# Altium schematic sheet relays1.SchDoc
size A4
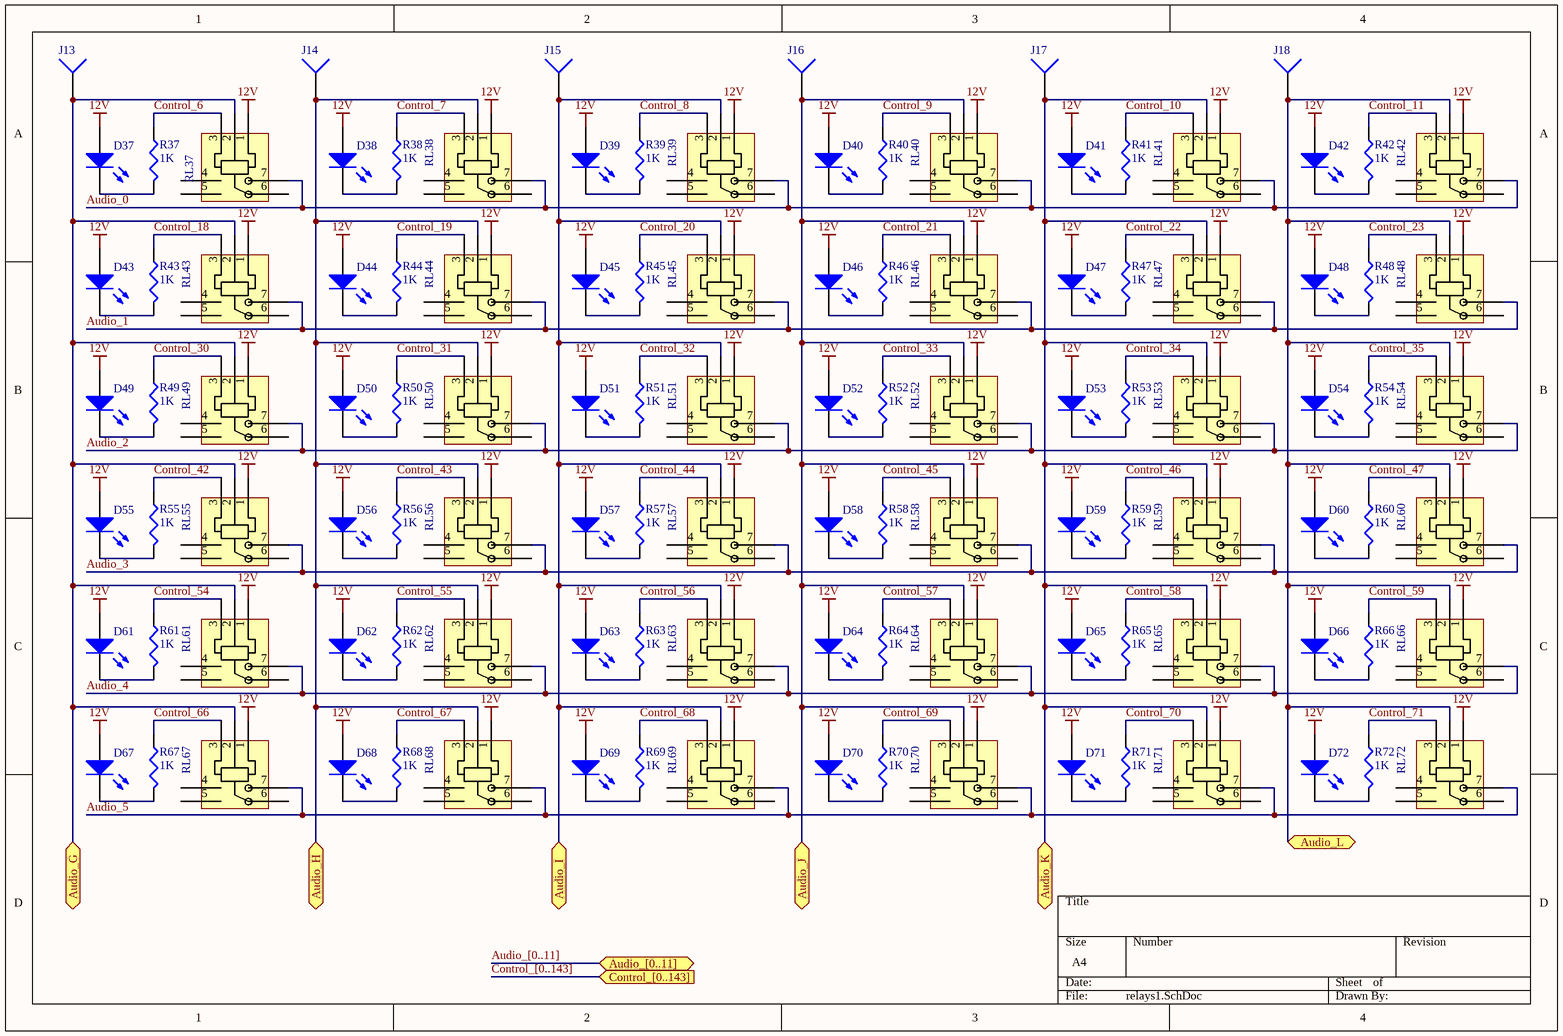
[diagram p0: relays1.SchDoc]

## Parts
D37  LED0  [LED_round_5mm]  (value not drawn)
D38  LED0  [LED_round_5mm]  (value not drawn)
D39  LED0  [LED_round_5mm]  (value not drawn)
D40  LED0  [LED_round_5mm]  (value not drawn)
D41  LED0  [LED_round_5mm]  (value not drawn)
D42  LED0  [LED_round_5mm]  (value not drawn)
D43  LED0  [LED_round_5mm]  (value not drawn)
D44  LED0  [LED_round_5mm]  (value not drawn)
D45  LED0  [LED_round_5mm]  (value not drawn)
D46  LED0  [LED_round_5mm]  (value not drawn)
D47  LED0  [LED_round_5mm]  (value not drawn)
D48  LED0  [LED_round_5mm]  (value not drawn)
D49  LED0  [LED_round_5mm]  (value not drawn)
D50  LED0  [LED_round_5mm]  (value not drawn)
D51  LED0  [LED_round_5mm]  (value not drawn)
D52  LED0  [LED_round_5mm]  (value not drawn)
D53  LED0  [LED_round_5mm]  (value not drawn)
D54  LED0  [LED_round_5mm]  (value not drawn)
D55  LED0  [LED_round_5mm]  (value not drawn)
D56  LED0  [LED_round_5mm]  (value not drawn)
D57  LED0  [LED_round_5mm]  (value not drawn)
D58  LED0  [LED_round_5mm]  (value not drawn)
D59  LED0  [LED_round_5mm]  (value not drawn)
D60  LED0  [LED_round_5mm]  (value not drawn)
D61  LED0  [LED_round_5mm]  (value not drawn)
D62  LED0  [LED_round_5mm]  (value not drawn)
D63  LED0  [LED_round_5mm]  (value not drawn)
D64  LED0  [LED_round_5mm]  (value not drawn)
D65  LED0  [LED_round_5mm]  (value not drawn)
D66  LED0  [LED_round_5mm]  (value not drawn)
D67  LED0  [LED_round_5mm]  (value not drawn)
D68  LED0  [LED_round_5mm]  (value not drawn)
D69  LED0  [LED_round_5mm]  (value not drawn)
D70  LED0  [LED_round_5mm]  (value not drawn)
D71  LED0  [LED_round_5mm]  (value not drawn)
D72  LED0  [LED_round_5mm]  (value not drawn)
J13  Audio  [Conn_1_2x4]  (value not drawn)
J14  Audio  [Conn_1_2x4]  (value not drawn)
J15  Audio  [Conn_1_2x4]  (value not drawn)
J16  Audio  [Conn_1_2x4]  (value not drawn)
J17  Audio  [Conn_1_2x4]  (value not drawn)
J18  Audio  [Conn_1_2x4]  (value not drawn)
R37  value 1K  [J1-0603]  (hidden comment: Res3)
R38  value 1K  [J1-0603]  (hidden comment: Res3)
R39  value 1K  [J1-0603]  (hidden comment: Res3)
R40  value 1K  [J1-0603]  (hidden comment: Res3)
R41  value 1K  [J1-0603]  (hidden comment: Res3)
R42  value 1K  [J1-0603]  (hidden comment: Res3)
R43  value 1K  [J1-0603]  (hidden comment: Res3)
R44  value 1K  [J1-0603]  (hidden comment: Res3)
R45  value 1K  [J1-0603]  (hidden comment: Res3)
R46  value 1K  [J1-0603]  (hidden comment: Res3)
R47  value 1K  [J1-0603]  (hidden comment: Res3)
R48  value 1K  [J1-0603]  (hidden comment: Res3)
R49  value 1K  [J1-0603]  (hidden comment: Res3)
R50  value 1K  [J1-0603]  (hidden comment: Res3)
R51  value 1K  [J1-0603]  (hidden comment: Res3)
R52  value 1K  [J1-0603]  (hidden comment: Res3)
R53  value 1K  [J1-0603]  (hidden comment: Res3)
R54  value 1K  [J1-0603]  (hidden comment: Res3)
R55  value 1K  [J1-0603]  (hidden comment: Res3)
R56  value 1K  [J1-0603]  (hidden comment: Res3)
R57  value 1K  [J1-0603]  (hidden comment: Res3)
R58  value 1K  [J1-0603]  (hidden comment: Res3)
R59  value 1K  [J1-0603]  (hidden comment: Res3)
R60  value 1K  [J1-0603]  (hidden comment: Res3)
R61  value 1K  [J1-0603]  (hidden comment: Res3)
R62  value 1K  [J1-0603]  (hidden comment: Res3)
R63  value 1K  [J1-0603]  (hidden comment: Res3)
R64  value 1K  [J1-0603]  (hidden comment: Res3)
R65  value 1K  [J1-0603]  (hidden comment: Res3)
R66  value 1K  [J1-0603]  (hidden comment: Res3)
R67  value 1K  [J1-0603]  (hidden comment: Res3)
R68  value 1K  [J1-0603]  (hidden comment: Res3)
R69  value 1K  [J1-0603]  (hidden comment: Res3)
R70  value 1K  [J1-0603]  (hidden comment: Res3)
R71  value 1K  [J1-0603]  (hidden comment: Res3)
R72  value 1K  [J1-0603]  (hidden comment: Res3)
RL37  Relay  [Relay_FRA3]  (value not drawn)
RL38  Relay  [Relay_FRA3]  (value not drawn)
RL39  Relay  [Relay_FRA3]  (value not drawn)
RL40  Relay  [Relay_FRA3]  (value not drawn)
RL41  Relay  [Relay_FRA3]  (value not drawn)
RL42  Relay  [Relay_FRA3]  (value not drawn)
RL43  Relay  [Relay_FRA3]  (value not drawn)
RL44  Relay  [Relay_FRA3]  (value not drawn)
RL45  Relay  [Relay_FRA3]  (value not drawn)
RL46  Relay  [Relay_FRA3]  (value not drawn)
RL47  Relay  [Relay_FRA3]  (value not drawn)
RL48  Relay  [Relay_FRA3]  (value not drawn)
RL49  Relay  [Relay_FRA3]  (value not drawn)
RL50  Relay  [Relay_FRA3]  (value not drawn)
RL51  Relay  [Relay_FRA3]  (value not drawn)
RL52  Relay  [Relay_FRA3]  (value not drawn)
RL53  Relay  [Relay_FRA3]  (value not drawn)
RL54  Relay  [Relay_FRA3]  (value not drawn)
RL55  Relay  [Relay_FRA3]  (value not drawn)
RL56  Relay  [Relay_FRA3]  (value not drawn)
RL57  Relay  [Relay_FRA3]  (value not drawn)
RL58  Relay  [Relay_FRA3]  (value not drawn)
RL59  Relay  [Relay_FRA3]  (value not drawn)
RL60  Relay  [Relay_FRA3]  (value not drawn)
RL61  Relay  [Relay_FRA3]  (value not drawn)
RL62  Relay  [Relay_FRA3]  (value not drawn)
RL63  Relay  [Relay_FRA3]  (value not drawn)
RL64  Relay  [Relay_FRA3]  (value not drawn)
RL65  Relay  [Relay_FRA3]  (value not drawn)
RL66  Relay  [Relay_FRA3]  (value not drawn)
RL67  Relay  [Relay_FRA3]  (value not drawn)
RL68  Relay  [Relay_FRA3]  (value not drawn)
RL69  Relay  [Relay_FRA3]  (value not drawn)
RL70  Relay  [Relay_FRA3]  (value not drawn)
RL71  Relay  [Relay_FRA3]  (value not drawn)
RL72  Relay  [Relay_FRA3]  (value not drawn)

## Ports
Audio_[0..11] (bidir), Audio_G (bidir), Audio_H (bidir), Audio_I (bidir), Audio_J (bidir), Audio_K (bidir), Audio_L (bidir), Control_[0..143] (in)

## Nets
12V: D37.1(A) D38.1(A) D39.1(A) D40.1(A) D41.1(A) D42.1(A) D43.1(A) D44.1(A) D45.1(A) D46.1(A) D47.1(A) D48.1(A) D49.1(A) D50.1(A) D51.1(A) D52.1(A) D53.1(A) D54.1(A) D55.1(A) D56.1(A) D57.1(A) D58.1(A) D59.1(A) D60.1(A) D61.1(A) D62.1(A) D63.1(A) D64.1(A) D65.1(A) D66.1(A) D67.1(A) D68.1(A) D69.1(A) D70.1(A) D71.1(A) D72.1(A) RL37.1 RL38.1 RL39.1 RL40.1 RL41.1 RL42.1 RL43.1 RL44.1 RL45.1 RL46.1 RL47.1 RL48.1 RL49.1 RL50.1 RL51.1 RL52.1 RL53.1 RL54.1 RL55.1 RL56.1 RL57.1 RL58.1 RL59.1 RL60.1 RL61.1 RL62.1 RL63.1 RL64.1 RL65.1 RL66.1 RL67.1 RL68.1 RL69.1 RL70.1 RL71.1 RL72.1
Audio_0: RL37.7 RL38.7 RL39.7 RL40.7 RL41.7 RL42.7
Audio_1: RL43.7 RL44.7 RL45.7 RL46.7 RL47.7 RL48.7
Audio_2: RL49.7 RL50.7 RL51.7 RL52.7 RL53.7 RL54.7
Audio_3: RL55.7 RL56.7 RL57.7 RL58.7 RL59.7 RL60.7
Audio_4: RL61.7 RL62.7 RL63.7 RL64.7 RL65.7 RL66.7
Audio_5: RL67.7 RL68.7 RL69.7 RL70.7 RL71.7 RL72.7
Audio_G: J13.1 RL37.2 RL43.2 RL49.2 RL55.2 RL61.2 RL67.2 ; port Audio_G
Audio_H: J14.1 RL38.2 RL44.2 RL50.2 RL56.2 RL62.2 RL68.2 ; port Audio_H
Audio_I: J15.1 RL39.2 RL45.2 RL51.2 RL57.2 RL63.2 RL69.2 ; port Audio_I
Audio_J: J16.1 RL40.2 RL46.2 RL52.2 RL58.2 RL64.2 RL70.2 ; port Audio_J
Audio_K: J17.1 RL41.2 RL47.2 RL53.2 RL59.2 RL65.2 RL71.2 ; port Audio_K
Audio_L: J18.1 RL42.2 RL48.2 RL54.2 RL60.2 RL66.2 RL72.2 ; port Audio_L
Control_6: R37.1 RL37.3
Control_7: R38.1 RL38.3
Control_8: R39.1 RL39.3
Control_9: R40.1 RL40.3
Control_10: R41.1 RL41.3
Control_11: R42.1 RL42.3
Control_18: R43.1 RL43.3
Control_19: R44.1 RL44.3
Control_20: R45.1 RL45.3
Control_21: R46.1 RL46.3
Control_22: R47.1 RL47.3
Control_23: R48.1 RL48.3
Control_30: R49.1 RL49.3
Control_31: R50.1 RL50.3
Control_32: R51.1 RL51.3
Control_33: R52.1 RL52.3
Control_34: R53.1 RL53.3
Control_35: R54.1 RL54.3
Control_42: R55.1 RL55.3
Control_43: R56.1 RL56.3
Control_44: R57.1 RL57.3
Control_45: R58.1 RL58.3
Control_46: R59.1 RL59.3
Control_47: R60.1 RL60.3
Control_54: R61.1 RL61.3
Control_55: R62.1 RL62.3
Control_56: R63.1 RL63.3
Control_57: R64.1 RL64.3
Control_58: R65.1 RL65.3
Control_59: R66.1 RL66.3
Control_66: R67.1 RL67.3
Control_67: R68.1 RL68.3
Control_68: R69.1 RL69.3
Control_69: R70.1 RL70.3
Control_70: R71.1 RL71.3
Control_71: R72.1 RL72.3
NetD37_2: D37.2(K) R37.2
NetD38_2: D38.2(K) R38.2
NetD39_2: D39.2(K) R39.2
NetD40_2: D40.2(K) R40.2
NetD41_2: D41.2(K) R41.2
NetD42_2: D42.2(K) R42.2
NetD43_2: D43.2(K) R43.2
NetD44_2: D44.2(K) R44.2
NetD45_2: D45.2(K) R45.2
NetD46_2: D46.2(K) R46.2
NetD47_2: D47.2(K) R47.2
NetD48_2: D48.2(K) R48.2
NetD49_2: D49.2(K) R49.2
NetD50_2: D50.2(K) R50.2
NetD51_2: D51.2(K) R51.2
NetD52_2: D52.2(K) R52.2
NetD53_2: D53.2(K) R53.2
NetD54_2: D54.2(K) R54.2
NetD55_2: D55.2(K) R55.2
NetD56_2: D56.2(K) R56.2
NetD57_2: D57.2(K) R57.2
NetD58_2: D58.2(K) R58.2
NetD59_2: D59.2(K) R59.2
NetD60_2: D60.2(K) R60.2
NetD61_2: D61.2(K) R61.2
NetD62_2: D62.2(K) R62.2
NetD63_2: D63.2(K) R63.2
NetD64_2: D64.2(K) R64.2
NetD65_2: D65.2(K) R65.2
NetD66_2: D66.2(K) R66.2
NetD67_2: D67.2(K) R67.2
NetD68_2: D68.2(K) R68.2
NetD69_2: D69.2(K) R69.2
NetD70_2: D70.2(K) R70.2
NetD71_2: D71.2(K) R71.2
NetD72_2: D72.2(K) R72.2

Not connected (* = marked no-connect by the designer): RL37 4 5 6; RL38 4 5 6; RL39 4 5 6; RL40 4 5 6; RL41 4 5 6; RL42 4 5 6; RL43 4 5 6; RL44 4 5 6; RL45 4 5 6; RL46 4 5 6; RL47 4 5 6; RL48 4 5 6; RL49 4 5 6; RL50 4 5 6; RL51 4 5 6; RL52 4 5 6; RL53 4 5 6; RL54 4 5 6; RL55 4 5 6; RL56 4 5 6; RL57 4 5 6; RL58 4 5 6; RL59 4 5 6; RL60 4 5 6; RL61 4 5 6; RL62 4 5 6; RL63 4 5 6; RL64 4 5 6; RL65 4 5 6; RL66 4 5 6; RL67 4 5 6; RL68 4 5 6; RL69 4 5 6; RL70 4 5 6; RL71 4 5 6; RL72 4 5 6

## Buses and harness runs
bus Audio_[0..11] = port Audio_[0..11]
bus Control_[0..143] = port Control_[0..143]

## Library data of the parts
D37-D72 = LED0: Typical INFRARED GaAs LED; Published: 8-Jun-2000; LatestRevisionDate: 08-Jul-2005; LatestRevisionNote: Mech Layer 1 removed.; PackageReference: LED-0; Publisher: Altium Limited; PackageDescription: LED; 2 Leads
J13-J18 = Socket: LatestRevisionDate: 17-Jul-2002; LatestRevisionNote: Re-released for DXP Platform.; Publisher: Altium Limited
R37-R72 = Res3: Resistor; Published: 8-Jun-2000; LatestRevisionDate: 29-May-2009; LatestRevisionNote: IPC-7351 Footprint Added.; PackageReference: J1-0603; Publisher: Altium Limited; PackageDescription: Chip Resistor
RL37-RL72 = Relay_FRA3: Miniature power relay; Part number: FRA3C-DC12